# Altium schematic sheet ECG_AFE_ADS1292.SchDoc
size A3; SheetNumber: 6; SheetTotal: 6
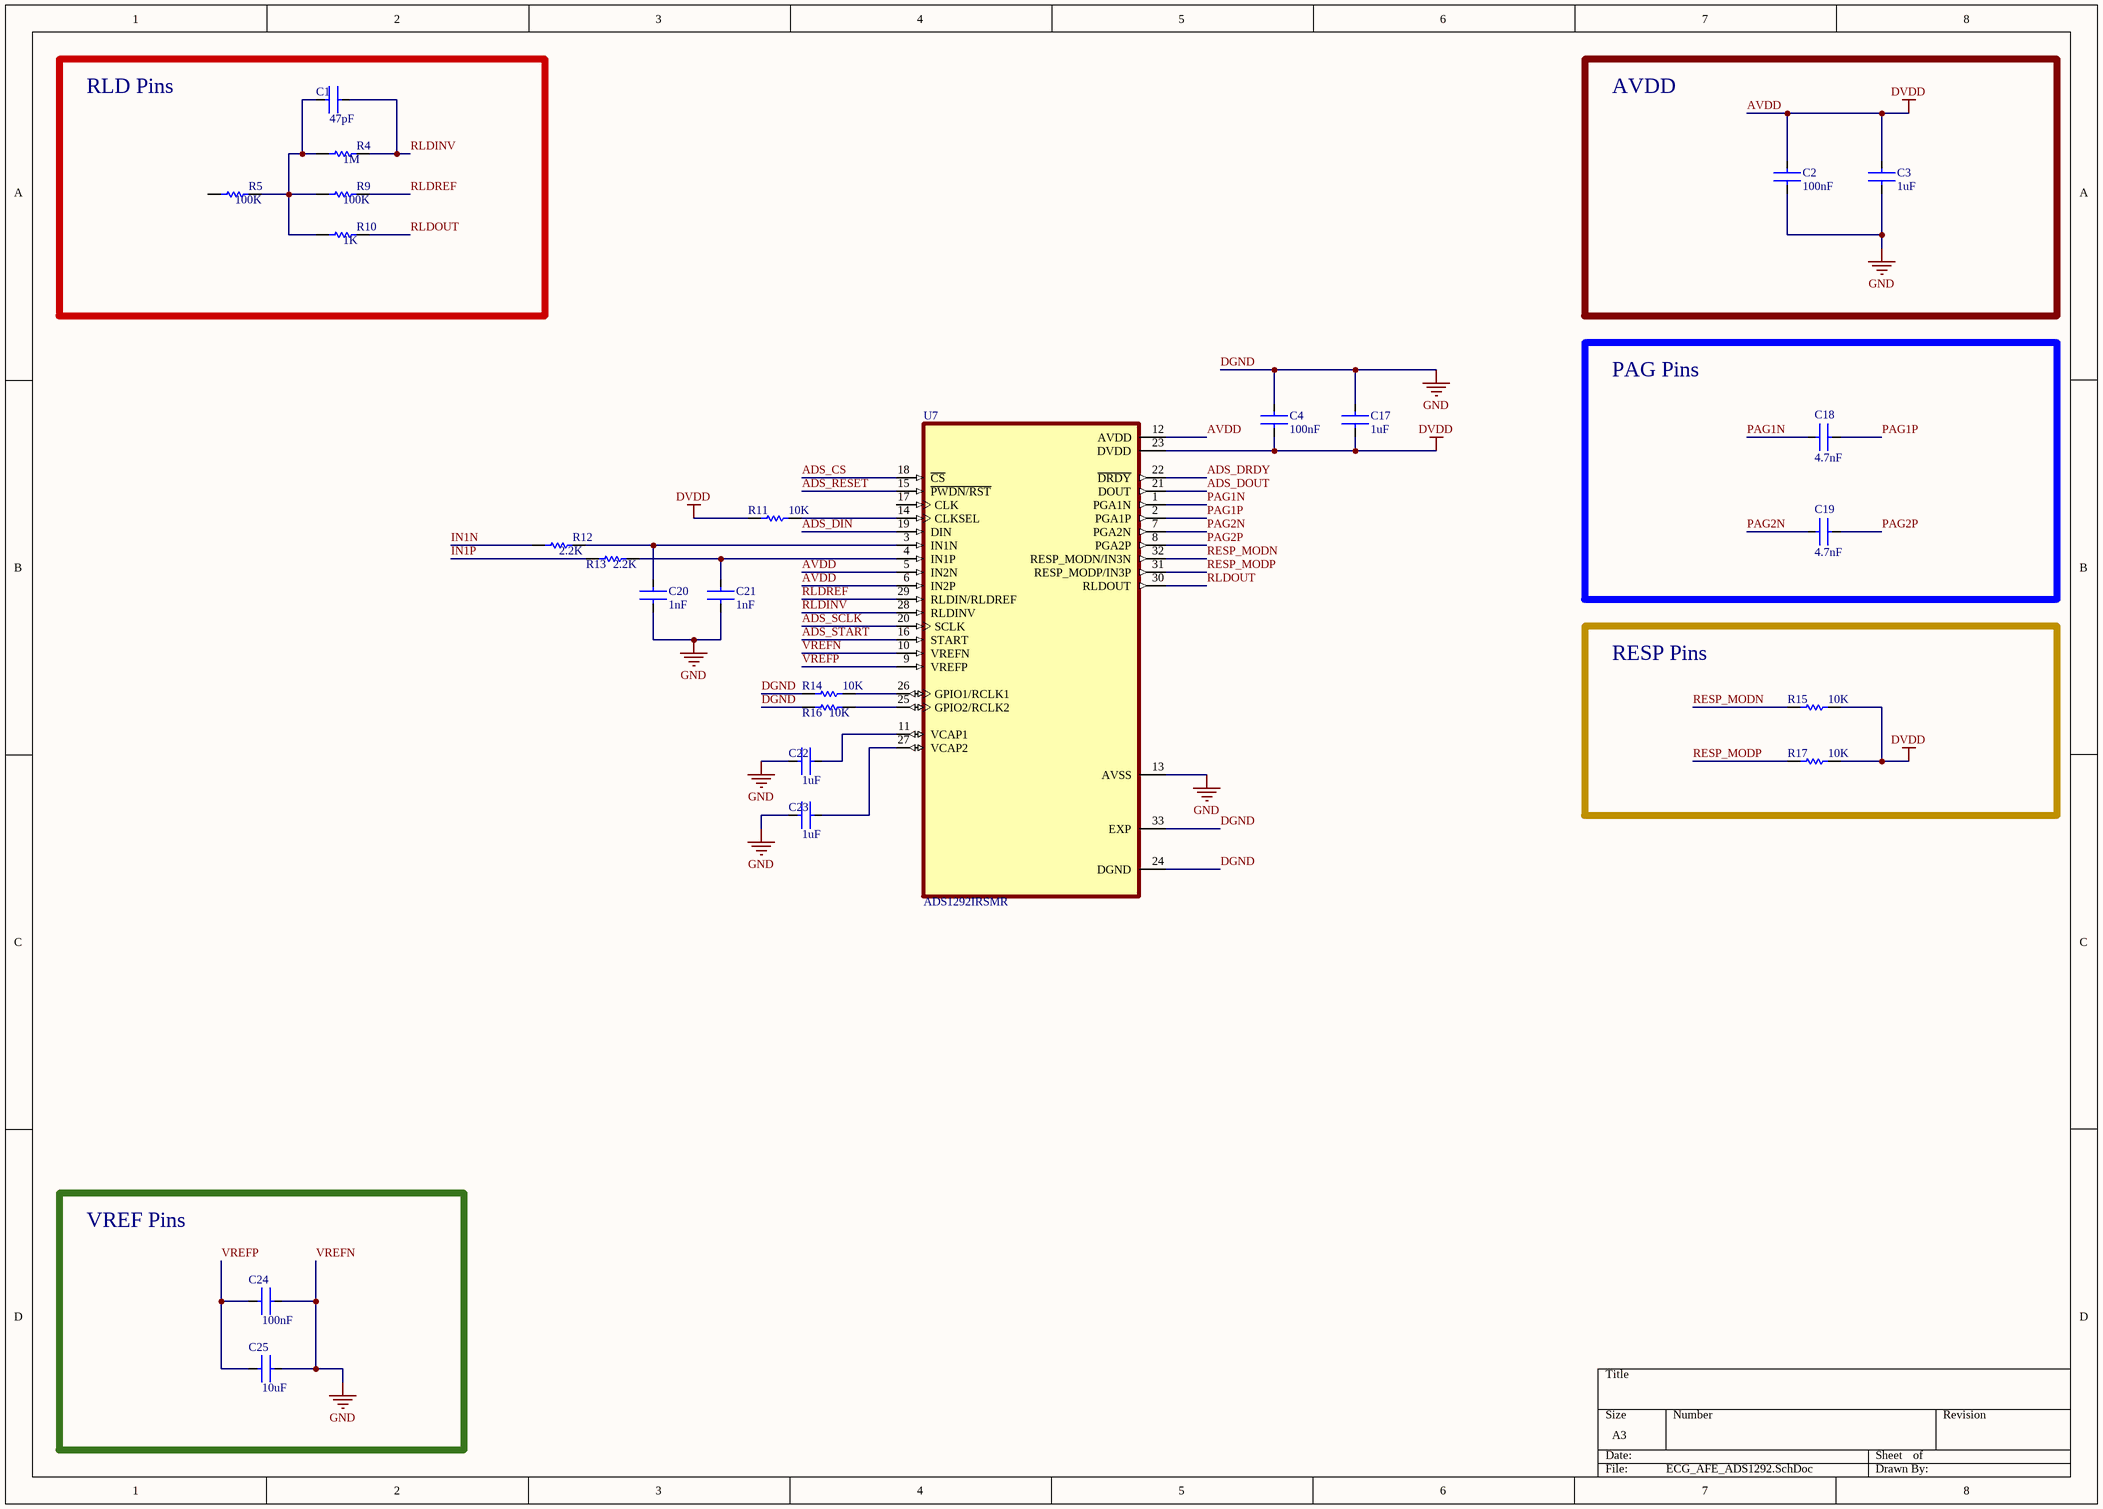
[diagram p0: ECG_AFE_ADS1292.SchDoc]

## Parts
C1  47pF  [C_0805]
C2  100nF  [C_0805]
C3  1uF  [C_0805]
C4  100nF  [C_0805]
C17  1uF  [C_0805]
C18  4.7nF  [C_0805]
C19  4.7nF  [C_0805]
C20  1nF  [C_0805]
C21  1nF  [C_0805]
C22  1uF  [C_0805]
C23  1uF  [C_0805]
C24  100nF  [C_0805]
C25  10uF  [C_0805]
R4  1M  [RESC2013X60X35ML10T20]
R5  100K  [RESC2013X60X35ML10T20]
R9  100K  [RESC2013X60X35ML10T20]
R10  1K  [RESC2013X60X35ML10T20]
R11  10K  [RESC2013X60X35ML10T20]
R12  2.2K  [RESC2013X60X35ML10T20]
R13  2.2K  [RESC2013X60X35ML10T20]
R14  10K  [RESC2013X60X35ML10T20]
R15  10K  [RESC2013X60X35ML10T20]
R16  10K  [RESC2013X60X35ML10T20]
R17  10K  [RESC2013X60X35ML10T20]
U7  ADS1292IRSMR  [QFN40P400X400X100-33N]

## Blocks framed on the sheet
RLD Pins: C1 R4 R5 R9 R10
AVDD: C2 C3
PAG Pins: C18 C19
RESP Pins: R15 R17
VREF Pins: C24 C25

## Nets
AVDD: C2.2 C3.2 C4.1 C17.1 R11.1 R15.2 R17.2 U7.5(IN2N) U7.6(IN2P) U7.12(AVDD) U7.23(DVDD)  [also labelled DVDD]
DGND: C2.1 C3.1 C4.2 C17.2 C20.1 C21.1 C22.1 C23.1 C24.2 C25.2 R14.1 R16.1 U7.10(VREFN) U7.13(AVSS) U7.24(DGND) U7.33(EXP)  [also labelled GND, VREFN]
ADS_CS: U7.18(~{CS})
ADS_DIN: U7.19(DIN)
ADS_DOUT: U7.21(DOUT)
ADS_DRDY: U7.22(~{DRDY})
ADS_RESET: U7.15(~{PWDN/RST})
ADS_SCLK: U7.20(SCLK)
ADS_START: U7.16(START)
IN1N: R12.1
IN1P: R13.1
PAG1N: C18.2 U7.1(PGA1N)
PAG1P: C18.1 U7.2(PGA1P)
PAG2N: C19.2 U7.7(PGA2N)
PAG2P: C19.1 U7.8(PGA2P)
RESP_MODN: R15.1 U7.32(RESP_MODN/IN3N)
RESP_MODP: R17.1 U7.31(RESP_MODP/IN3P)
RLDINV: C1.2 R4.2 U7.28(RLDINV)
RLDOUT: R10.2 U7.30(RLDOUT)
RLDREF: R9.2 U7.29(RLDIN/RLDREF)
VREFP: C24.1 C25.1 U7.9(VREFP)
NetC1_1: C1.1 R4.1 R5.2 R9.1 R10.1
NetC20_2: C20.2 R12.2 U7.3(IN1N)
NetC21_2: C21.2 R13.2 U7.4(IN1P)
NetC22_2: C22.2 U7.11(VCAP1)
NetC23_2: C23.2 U7.27(VCAP2)
NetR11_2: R11.2 U7.14(CLKSEL)
NetR14_2: R14.2 U7.26(GPIO1/RCLK1)
NetR16_2: R16.2 U7.25(GPIO2/RCLK2)

Not connected (* = marked no-connect by the designer): R5 1; U7 17(CLK)

## Library data of the parts
C1-C4 C17-C25 = CAP-0805-16V-SMD-IPC_A
R4 R5 R9-R17 = 10k 0805
U7 = ADS1292IRSMR: 24-bit, 2-ch, Low-Power Analog Front END (AFE) for ECG Applications; MF: Texas Instruments; SnapEDA_Link: https://www.snapeda.com/parts/ADS1292IRSMR/Texas+Instruments/view-part/?ref=snap; Package: VQFN-32 Texas Instruments; Value: *; MP: ADS1292IRSMR; Check_prices: https://www.snapeda.com/parts/ADS1292IRSMR/Texas+Instruments/view-part/?ref=eda